# EAGLE design ESP32-S3 AT UWB Pro with Display v1.0 (EAGLE 6.1)
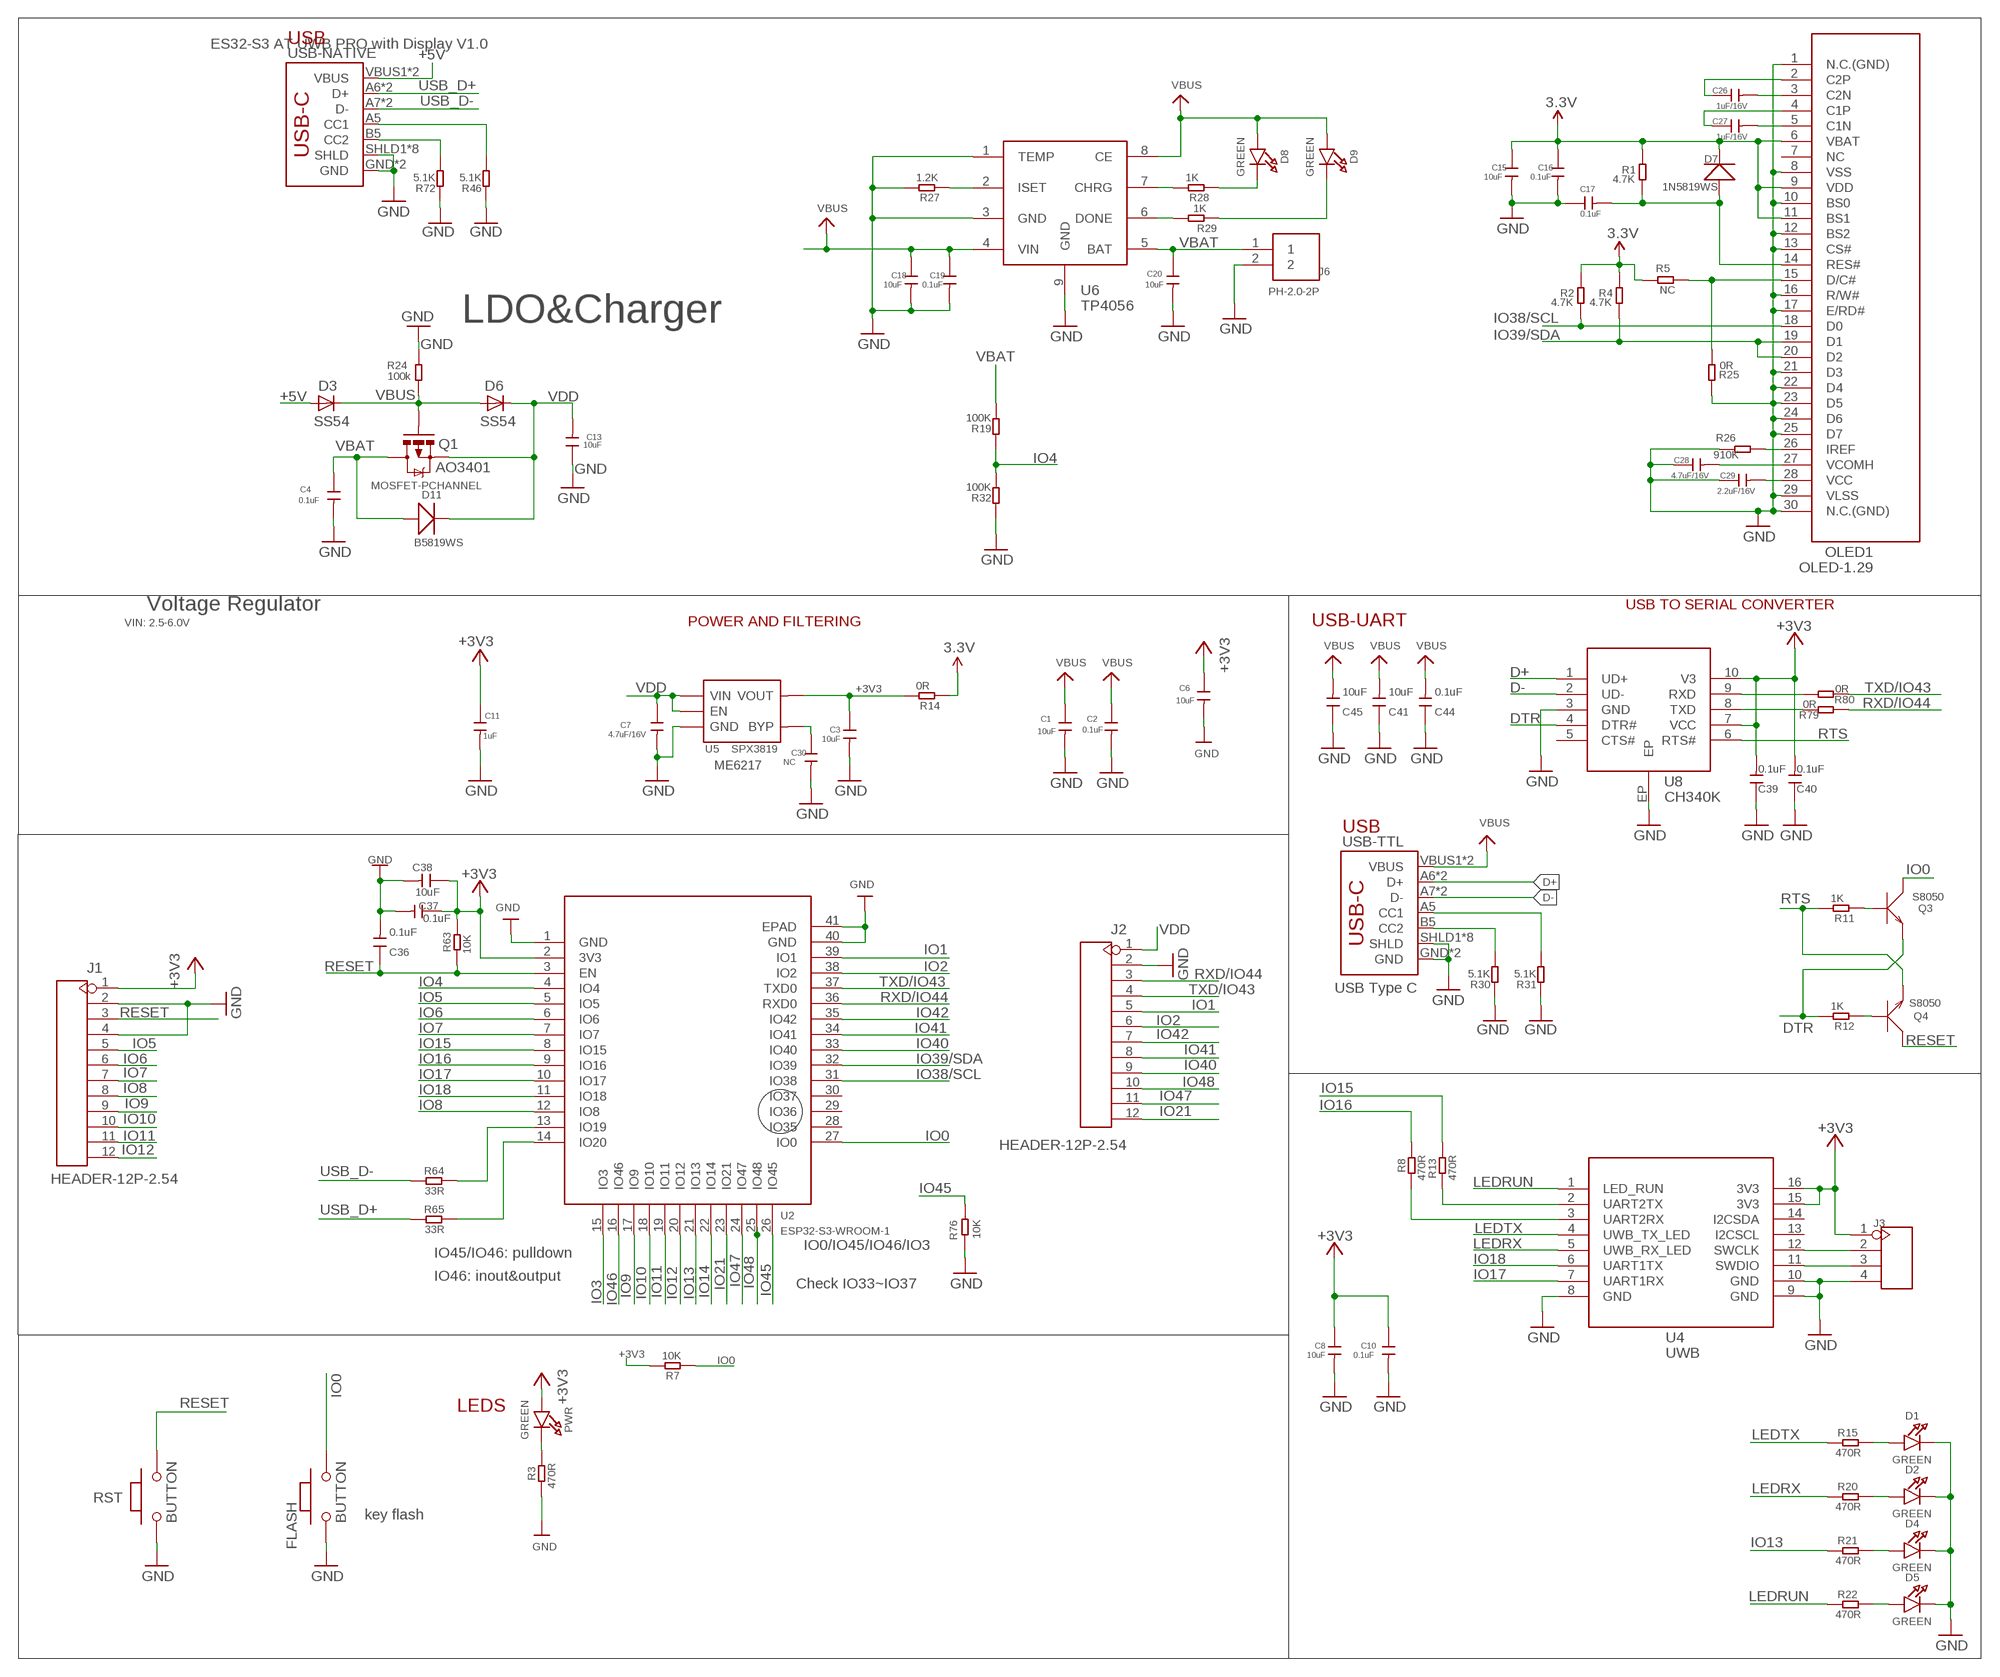
[diagram p0: schematic, sheet 1]

## Parts
C1  10uF  C-0603  [0603]
C2  0.1uF  C-0603  [0603]
C3  10uF  C-0603  [0603]
C4  0.1uF  C-0603  [0603]
C6  10uF  C-0603  [0603]
C7  4.7uF/16V  C-0603  [0603]
C8  10uF  C-0603  [0603]
C10  0.1uF  C-0603  [0603]
C11  1uF  C-0603  [0603]
C13  10uF  C-0603  [0603]
C15  10uF  C-0603  [0603]
C16  0.1uF  C-0603  [0603]
C17  0.1uF  C-0603  [0603]
C18  10uF  C-0603  [0603]
C19  0.1uF  C-0603  [0603]
C20  10uF  C-0603  [0603]
C26  1uF/16V  C-0603  [0603]
C27  1uF/16V  C-0603  [0603]
C28  4.7uF/16V  C-0603  [0603]
C29  2.2uF/16V  C-0603  [0603]
C30  NC  C-0603  [0603]
C36  0.1uF  DISCRETE_C-0603  [DISCRETE_C0603]
C37  0.1uF  DISCRETE_C-0603  [DISCRETE_C0603]
C38  10uF  DISCRETE_C-0603  [DISCRETE_C0603]
C39  0.1uF  DISCRETE_C-0603  [DISCRETE_C0603]
C40  0.1uF  DISCRETE_C-0603  [DISCRETE_C0603]
C41  10uF  DISCRETE_C-0603  [DISCRETE_C0603]
C44  0.1uF  DISCRETE_C-0603  [DISCRETE_C0603]
C45  10uF  DISCRETE_C-0603  [DISCRETE_C0603]
D1  GREEN  LED0805_NOOUTLINE  [CHIPLED_0805_NOOUTLINE]
D2  GREEN  LED0805_NOOUTLINE  [CHIPLED_0805_NOOUTLINE]
D3  SS54  DIODE-DO-214AC  [DO-214AC]
D4  GREEN  LED0805_NOOUTLINE  [CHIPLED_0805_NOOUTLINE]
D5  GREEN  LED0805_NOOUTLINE  [CHIPLED_0805_NOOUTLINE]
D6  SS54  DIODE-DO-214AC  [DO-214AC]
D7  1N5819WS  D'0805'  [SOD323]
D8  GREEN  LED0805_NOOUTLINE  [CHIPLED_0805_NOOUTLINE]
D9  GREEN  LED0805_NOOUTLINE  [CHIPLED_0805_NOOUTLINE]
D11  B5819WS  D'0805'  [SOD323]
FLASH  BUTTON  PB157  [157SW]
J1  HEADER-12P-2.54  [12P-2.54]
J2  HEADER-12P-2.54  [12P-2.54]
J3  HEADER-4P-60/35MILROUND  [4P-65/35ROUND]
J6  PH-2.0-2P  [PH-2.0-2P]
OLED1  OLED-1.29  [OLED-1.29]
PWR  GREEN  LED0805_NOOUTLINE  [CHIPLED_0805_NOOUTLINE]
Q1  MOSFET-PCHANNEL  [SOT23-3]
Q3  S8050  TRANSISTOR-NPN-SOT23  [SOT23]
Q4  S8050  TRANSISTOR-NPN-SOT23  [SOT23]
R1  4.7K  R-0603  [R0603]
R2  4.7K  R-0603  [R0603]
R3  470R  R-0603  [R0603]
R4  4.7K  R-0603  [R0603]
R5  NC  R-0603  [R0603]
R7  10K  R-0603  [R0603]
R8  470R  R-0603  [R0603]
R11  1K  R-0603  [R0603]
R12  1K  R-0603  [R0603]
R13  470R  R-0603  [R0603]
R14  0R  R-0603  [R0603]
R15  470R  R-0603  [R0603]
R19  100K  DISCRETE_R-0603  [DISCRETE_R0603]
R20  470R  R-0603  [R0603]
R21  470R  R-0603  [R0603]
R22  470R  R-0603  [R0603]
R24  100k  R-0603  [R0603]
R25  0R  R-0603  [R0603]
R26  910K  R-0603  [R0603]
R27  1.2K  R-0603  [R0603]
R28  1K  R-0603  [R0603]
R29  1K  R-0603  [R0603]
R30  5.1K  DISCRETE_R-0603  [DISCRETE_R0603]
R31  5.1K  DISCRETE_R-0603  [DISCRETE_R0603]
R32  100K  DISCRETE_R-0603  [DISCRETE_R0603]
R46  5.1K  DISCRETE_R-0603  [DISCRETE_R0603]
R63  10K  R-0603  [R0603]
R64  33R  R-0603  [R0603]
R65  33R  R-0603  [R0603]
R72  5.1K  DISCRETE_R-0603  [DISCRETE_R0603]
R76  10K  R-0603  [R0603]
R79  0R  R-0603  [R0603]
R80  0R  R-0603  [R0603]
RST  BUTTON  PB157  [157SW]
U2  ESP32-S3-WROOM-1  [ESP32-S3-WROOM-1]
U4  UWB  [UWB]
U5  SPX3819  [SOT23-5]
U6  TP4056  [SOP8-1.27P]
U8  CH340K  [ESOP-10-EP-150MIL]
USB-NATIVE  USB_C5  [USB-C-16P-5]
USB-TTL  USB_C5  [USB-C-16P-5]

## Nets
3.3V: C15.1 C16.1 D7.- OLED1.6(VBAT) OLED1.9(VDD) OLED1.11(BS1) R1.2 R2.2 R4.2 R5.2 R14.1
+3V3: C3.1 C6.1 C8.1 C10.1 C11.1 C37.1 C38.1 C39.2 C40.2 J1.1 J3.1 PWR.A R7.2 R14.2 R63.2 U2.2(3V3) U4.15(3V3) U4.16(3V3) U5.5(VOUT) U8.7(VCC) U8.10(V3)
+5V: D3.A USB-NATIVE.VBUS1(VBUS) USB-NATIVE.VBUS2(VBUS)
D+: U8.1(UD+) USB-TTL.A6(D+) USB-TTL.B6(D+)
D-: U8.2(UD-) USB-TTL.A7(D-) USB-TTL.B7(D-)
DTR: Q3.2(E) R12.2 U8.4(DTR#)
GND: C1.2 C2.2 C3.2 C4.2 C6.2 C7.2 C8.2 C10.2 C11.2 C13.1 C15.2 C16.2 C17.1 C18.2 C19.2 C20.2 C28.1 C29.1 C30.2 C36.2 C37.2 C38.2 C39.1 C40.1 C41.1 C44.1 C45.1 D1.C D2.C D4.C D5.C FLASH.1 J1.2 J1.4 J2.2 J3.4 J6.2 OLED1.1(N.C.(GND)) OLED1.8(VSS) OLED1.10(BS0) OLED1.12(BS2) OLED1.13(CS#) OLED1.16(R/W#) OLED1.17(E/RD#) OLED1.21(D3) OLED1.22(D4) OLED1.23(D5) OLED1.24(D6) OLED1.25(D7) OLED1.29(VLSS) OLED1.30(N.C.(GND)) R3.1 R24.2 R25.2 R26.2 R27.2 R30.1 R31.1 R32.1 R46.1 R72.1 R76.1 RST.1 U2.1(GND) U2.40(GND) U2.41(EPAD) U4.8(GND) U4.9(GND) U4.10(GND) U5.2(GND) U6.1(TEMP) U6.3(GND) U6.9(GND) U8.3(GND) U8.EP USB-NATIVE.GND USB-NATIVE.GND2(GND) USB-NATIVE.SHLD1(SHLD) USB-NATIVE.SHLD2(SHLD) USB-NATIVE.SHLD3(SHLD) USB-NATIVE.SHLD4(SHLD) USB-NATIVE.SHLD5(SHLD) USB-NATIVE.SHLD6(SHLD) USB-NATIVE.SHLD7(SHLD) USB-NATIVE.SHLD8(SHLD) USB-TTL.GND USB-TTL.GND2(GND) USB-TTL.SHLD1(SHLD) USB-TTL.SHLD2(SHLD) USB-TTL.SHLD3(SHLD) USB-TTL.SHLD4(SHLD) USB-TTL.SHLD5(SHLD) USB-TTL.SHLD6(SHLD) USB-TTL.SHLD7(SHLD) USB-TTL.SHLD8(SHLD)
IO0: FLASH.2 Q3.3(C) R7.1 U2.27(IO0)
IO1: J2.5 U2.39(IO1)
IO2: J2.6 U2.38(IO2)
IO3: U2.15(IO3)
IO4: R19.1 R32.2 U2.4(IO4)
IO5: J1.5 U2.5(IO5)
IO6: J1.6 U2.6(IO6)
IO7: J1.7 U2.7(IO7)
IO8: J1.8 U2.12(IO8)
IO9: J1.9 U2.17(IO9)
IO10: J1.10 U2.18(IO10)
IO11: J1.11 U2.19(IO11)
IO12: J1.12 U2.20(IO12)
IO13: R21.1 U2.21(IO13)
IO14: U2.22(IO14)
IO15: R13.2 U2.8(IO15)
IO16: R8.2 U2.9(IO16)
IO17: U2.10(IO17) U4.7(UART1RX)
IO18: U2.11(IO18) U4.6(UART1TX)
IO21: J2.12 U2.23(IO21)
IO38/SCL: OLED1.18(D0) R2.1 U2.31(IO38)
IO39/SDA: OLED1.19(D1) OLED1.20(D2) R4.1 U2.32(IO39)
IO40: J2.9 U2.33(IO40)
IO41: J2.8 U2.34(IO41)
IO42: J2.7 U2.35(IO42)
IO45: R76.2 U2.26(IO45)
IO46: U2.16(IO46)
IO47: J2.11 U2.24(IO47)
IO48: J2.10 U2.25(IO48)
LEDRUN: R22.1 U4.1(LED_RUN)
LEDRX: R20.1 U4.5(UWB_RX_LED)
LEDTX: R15.1 U4.4(UWB_TX_LED)
N$1: D1.A R15.2
N$2: R64.2 U2.13(IO19)
N$3: C17.2 D7.+ OLED1.14(RES#) R1.1
N$4: OLED1.15(D/C#) R5.1 R25.1
N$5: PWR.C R3.2
N$6: C28.2 OLED1.27(VCOMH)
N$7: C26.2 OLED1.3(C2N)
N$8: C29.2 OLED1.28(VCC)
N$9: OLED1.26(IREF) R26.1
N$10: R13.1 U4.2(UART2TX)
N$11: R8.1 U4.3(UART2RX)
N$13: Q4.1(B) R12.1
N$14: Q3.1(B) R11.1
N$16: D2.A R20.2
N$17: D4.A R21.2
N$18: D5.A R22.2
N$19: C26.1 OLED1.2(C2P)
N$21: C27.1 OLED1.4(C1P)
N$22: C27.2 OLED1.5(C1N)
N$23: R27.1 U6.2(ISET)
N$25: R31.2 USB-TTL.A5(CC1)
N$26: R30.2 USB-TTL.B5(CC2)
N$27: J3.3 U4.11(SWDIO)
N$28: J3.2 U4.12(SWCLK)
N$29: R28.2 U6.7(CHRG)
N$30: R29.2 U6.6(DONE)
N$31: D8.C R28.1
N$32: D9.C R29.1
N$33: R46.2 USB-NATIVE.A5(CC1)
N$34: R72.2 USB-NATIVE.B5(CC2)
N$35: R65.2 U2.14(IO20)
N$36: R80.2 U8.9(RXD)
N$37: R79.2 U8.8(TXD)
N$76: C30.1 U5.4(BYP)
RESET: C36.1 J1.3 Q4.3(C) R63.1 RST.2 U2.3(EN)
RTS: Q4.2(E) R11.2 U8.6(RTS#)
RXD/IO44: J2.3 R79.1 U2.36(RXD0)
TXD/IO43: J2.4 R80.1 U2.37(TXD0)
USB_D+: R65.1 USB-NATIVE.A6(D+) USB-NATIVE.B6(D+)
USB_D-: R64.1 USB-NATIVE.A7(D-) USB-NATIVE.B7(D-)
VBAT: C4.1 C20.1 D11.+ J6.1 Q1.3(D) R19.2 U6.5(BAT)
VBUS: C1.1 C2.1 C18.1 C19.1 C41.2 C44.2 C45.2 D3.C D6.A D8.A D9.A Q1.1(G) R24.1 U6.4(VIN) U6.8(CE) USB-TTL.VBUS1(VBUS) USB-TTL.VBUS2(VBUS)
VDD: C7.1 C13.2 D6.C D11.- J2.1 Q1.2(S) U5.1(VIN) U5.3(EN)
Unconnected: OLED1.7(NC) U2.28(IO35) U2.29(IO36) U2.30(IO37) U4.13(I2CSCL) U4.14(I2CSDA) U8.5(CTS#)

## Notes on the sheet
- USB
- ES32-S3 AT UWB PRO with Display V1.0
- LDO&Charger
- AO3401
- Voltage Regulator
- USB TO SERIAL CONVERTER
- VIN: 2.5-6.0V | POWER AND FILTERING | USB-UART
- ME6217
- USB
- USB Type C
- IO0/IO45/IO46/IO3
- IO45/IO46: pulldown
- IO46: inout&output
- Check IO33~IO37
- LEDS
- key flash

## Library data of the parts
C1-C4 C6-C8 C10 C11 C13 C15-C20 C26-C30 = Discrete:C*: Ceramic Capacitors
C36-C41 C44 C45 = A9G:DISCRETE_C*: Ceramic Capacitors
D1 D2 D4 D5 D8 D9 PWR = microbuilder:LED: LED 0603 - 0603 Surface Mount Package 2mA: Green LED - Low Power (3.9mcd, 2ma, 1.7Vf) - Digikey: 475-2709-2-ND Orange LED - Low Power (9.8mcd, 2ma, 1.8Vf) - Digikey: 475-1194-2-ND Red LED - Low Power (5mcd, 2ma, 1.8Vf) - Digikey: 475-1195-2-ND Yellow LED - Low Power (7mcd, 2ma, 1.8Vf) - Digikey: 475-1196-2-ND 5mA: Blue LED - Low Power (17mcd, 5ma, 2.9Vf) - Digikey: LNJ937W8CRACT-ND 0805 - 0805 Surface Mount Package 2mA: Red LED (8.8mcd, 2mA, 1.8Vf, Clear) - Low Power [Digikey: 475-2510-1-ND] Green LED (5mcd, 2mA, 1.8Vf, Clear) - Low Power [Digikey: 475-2730-1-ND] Yellow LED (11.3mcd, 2mA, 1.8Vf, Clear) - Low Power [Digikey: 475-2555-1-ND] 20mA: Red LED (104mcd, 20mA, Diffused) - LS R976 [Digikey: 475-1278-6-ND] Red LED (12mcd, 20mA, 2.0Vf, Clear) - APT2012EC [Digikey: 754-1128-1-ND] Green LED (15mcd, 20mA, 2.2Vf, Clear) - APT2012GC [Digikey: 754-1131-1-ND] Orange LED (160mcd, 20mA, 2.1Vf, Clear) - APT2012SECK [Digikey: 754-1130-1-ND] 1206 - 1206 Surface Mount Package Green LED (26mcd, 20mA, Diffused) - LG N971 [Digikey: 475-1407-6-ND] Red LED (15mcd, 20mA, Diffused) - LH N974 [Digikey: 475-1416-6-ND] Cree - Cree High-Power Surface Mount LEDs XPEBWT-L1-0000-00D50 - White 111lm 350mA 2.9Vf 6200K 110° XTEAWT-00-0000-00000LEE3 - White 114lm 350mA 2.85Vf 5000K 115° Everlight - Everlight 45-21 Series Surface Mount LEDs 45-21/QK2C-B2832AC2CB2/2T - Warm White 2000mcd 20mA 3.25Vf 3050K 120° 45-21/LK2C-B38452C4CB2/2T - Nuetral White 2000mcd 20mA 3.25Vf 4150K 120° 45-21/LK2C-B50634C6CB2/2T - Cold White 2200mcd 20mA 3.25Vf 5650K 120° PLCC2 Reverse Mount LS T77K-J1L2-1-0-2-R18-Z - Red 11.25mcd 2mA 1.8Vf 630nm 120° LO T77K-L1M2-24-Z - Orange 19.6mcd 2mA 1.8Vf 606nm 120° LY T77K-K2M1-26-Z - Yellow 15.7mcd 2mA 1.8Vf 587nm 120°
D3 D6 = diode:DIODE-: DIODE
D7 D11 = Discrete:D*
FLASH RST = MySMD:PB157
J1 J2 = Connector:HEADER-12P
J3 = Connector:HEADER-4P
J6 = Connector:PH-2.0-2P
OLED1 = sale:OLED-1.29
Q1 = User-Submitted:MOSFET-PCHANNEL: Generic PMOSFET IRLML2244 - TRANS-11153 (SOT-23 -20V -4.3A) (1.Gate 2.Source 3.Drain) FQP27P06 - COM-10349 <http://www.sparkfun.com/products/10349> (TO-220 -60V -27A) (1.Gate 2.Source 3.Drain); PROD_ID: TRANS-08285
Q3 Q4 = Discrete:TRANSISTOR-NPN*: NPN audion
R1-R5 R7 R8 R11-R15 R20-R22 R24-R29 R63-R65 R76 R79 R80 = Discrete:R*
R19 R30-R32 R46 R72 = A9G:DISCRETE_R*
U2 = self:ESP32-S3-WROOM-1
U4 = sale:UWB
U5 = IC:SPX3819
U6 = self:TP4056
U8 = sale:CH340K
USB-NATIVE USB-TTL = USBC:USB_C: USB Type C 16Pin Connector Super Speed pins not available on the 16-pin purely SMD connector so this part is best for USB 2.0 implementations. D1 and D2 are tied together enabling D+/- no matter which way the cable is plugged into the connector. The two channel configuration pins (CC1/2) are exposed. These are normally connected to ground via 5.1k resistors but can be reconfigured for high current/high power applications.

## Net classes
0 default: width 0.203 mm

## Board
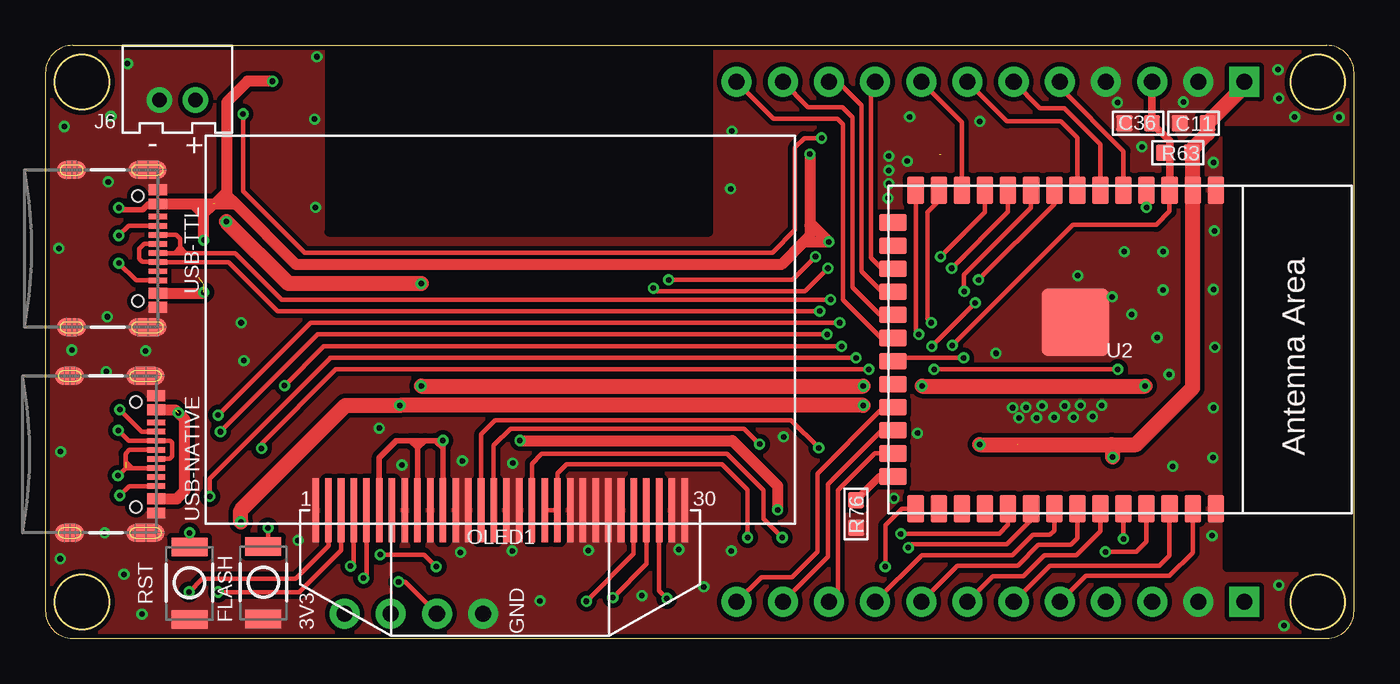
[diagram p1: board, top side]
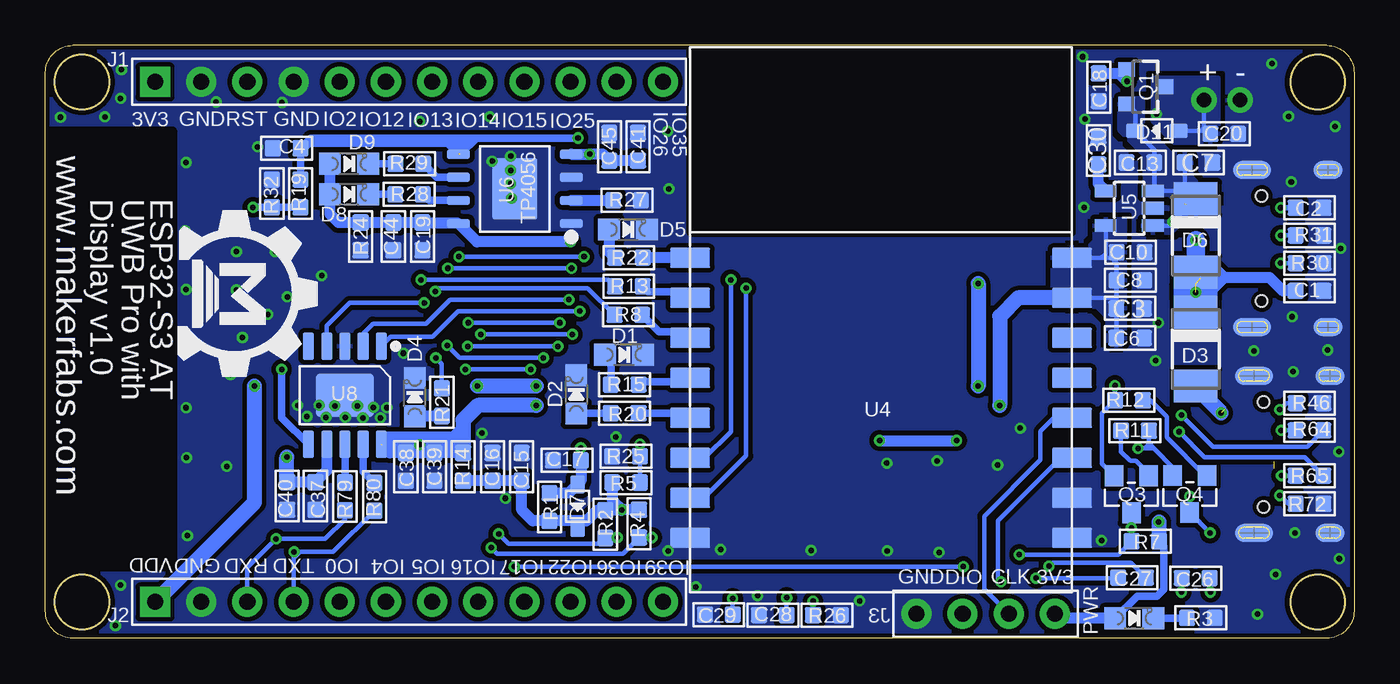
[diagram p2: board, bottom side, seen from below]

Size 72 x 32.6 mm. Coordinates in mm from the lower left corner, seen from the top.
Outline: 70.5,0 arc90 72,1.5 72,31.1 arc90 70.5,32.6 1.5,32.6 arc90 0,31.1 0,1.5 arc90 1.5,0 70.5,0
Outline: circle at 2,2 radius 1.5
Outline: circle at 2,30.6 radius 1.5
Outline: circle at 70,30.6 radius 1.5
Outline: circle at 70,2 radius 1.5
Copper layers (1*16): Top 0.035mm / dielectric 1.5mm / Bottom 0.035mm
Design rules: minimum track width 10mil, minimum drill 10mil, track to track 8mil, track to pad 8mil, pad to pad 8mil, via to via 8mil, smd to smd 0mil, copper to edge 10mil, drill to drill 8mil, minimum pad ring 10mil, minimum via ring 6mil, stop-mask expansion 4mil, vias tented up to drill 100mil, thermal gap 0mil
tRestrict: area 65,3.9 to 72,27.9; area 15.6,22.3 to 36.5,34.4
bRestrict: area 65,3.9 to 72,27.9; area 15.6,22.3 to 36.5,34.4

### Footprints (pad centres in the part's own frame; a part is rotated, then mirrored left to right if it is on the bottom)
0603 = smd 0.889 x 0.889: 1 -0.762,0; 2 0.762,0
DISCRETE_C0603 = smd 0.889 x 0.889: 1 -0.762,0; 2 0.762,0
CHIPLED_0805_NOOUTLINE = smd 1.2 x 1.2: A 0,-1.05; C 0,1.05
DO-214AC = smd 1.8 x 2.4: A 2.025,0; C -2.025,0
SOD323 = smd 1 x 0.8: + -1.2,0; - 1.2,0
157SW = smd 1.016 x 1.981: 1 0,0; 2 4,0
12P-2.54 = drill 0.889 pad 1.651 square: 1 0,13.97 | drill 0.889 pad 1.651: 2 0,11.43; 3 0,8.89; 4 0,6.35; 5 0,3.81; 6 0,1.27; 7 0,-1.27; 8 0,-3.81; 9 0,-6.35; 10 0,-8.89; 11 0,-11.43; 12 0,-13.97
4P-65/35ROUND = drill 0.889 pad 1.651: 1 0,3.81; 2 0,1.27; 3 0,-1.27; 4 0,-3.81
PH-2.0-2P = drill 0.8 pad 1.4: 1 -1,0; 2 1,0
OLED-1.29 = smd 0.4 x 3.5: 1 -10.15,-9.94; 2 -9.45,-9.94; 3 -8.75,-9.94; 4 -8.05,-9.94; 5 -7.35,-9.94; 6 -6.65,-9.94; 7 -5.95,-9.94; 8 -5.25,-9.94; 9 -4.55,-9.94; 10 -3.85,-9.94; 11 -3.15,-9.94; 12 -2.45,-9.94; 13 -1.75,-9.94; 14 -1.05,-9.94; 15 -0.35,-9.94; 16 0.35,-9.94; 17 1.05,-9.94; 18 1.75,-9.94; 19 2.45,-9.94; 20 3.15,-9.94; 21 3.85,-9.94; 22 4.55,-9.94; 23 5.25,-9.94; 24 5.95,-9.94; 25 6.65,-9.94; 26 7.35,-9.94; 27 8.05,-9.94; 28 8.75,-9.94; 29 9.45,-9.94; 30 10.15,-9.94
SOT23-3 = smd 0.8 x 0.9: 1 -0.95,-1; 2 0.95,-1; 3 0,1.1
SOT23 = smd 1.016 x 1.143: 1 -0.95,-1.016; 2 0.95,-1.016; 3 0,1.016
R0603 = smd 0.889 x 0.889: 1 -0.762,0; 2 0.762,0
DISCRETE_R0603 = smd 0.889 x 0.889: 1 -0.762,0; 2 0.762,0
ESP32-S3-WROOM-1 = smd 1.5 x 0.9: 1 -8.75,5.26; 2 -8.75,3.99; 3 -8.75,2.72; 4 -8.75,1.45; 5 -8.75,0.18; 6 -8.75,-1.09; 7 -8.75,-2.36; 8 -8.75,-3.63; 9 -8.75,-4.9; 10 -8.75,-6.17; 11 -8.75,-7.44; 12 -8.75,-8.71; 13 -8.75,-9.98; 14 -8.75,-11.25; 27 8.75,-11.25; 28 8.75,-9.98; 29 8.75,-8.71; 30 8.75,-7.44; 31 8.75,-6.17; 32 8.75,-4.9; 33 8.75,-3.63; 34 8.75,-2.36; 35 8.75,-1.09; 36 8.75,0.18; 37 8.75,1.45; 38 8.75,2.72; 39 8.75,3.99; 40 8.75,5.26 | smd 0.9 x 1.5: 15 -6.985,-12.5; 16 -5.715,-12.5; 17 -4.445,-12.5; 18 -3.175,-12.5; 19 -1.905,-12.5; 20 -0.635,-12.5; 21 0.635,-12.5; 22 1.905,-12.5; 23 3.175,-12.5; 24 4.445,-12.5; 25 5.715,-12.5; 26 6.985,-12.5 | smd 3.7 x 3.7: 41 -1.5,-2.46
UWB = smd 2.2 x 1.1: 1 0,18.4; 2 0,16.2; 3 0,14; 4 0,11.8; 5 0,9.6; 6 0,7.4; 7 0,5.2; 8 0,3; 9 21,3; 10 21,5.2; 11 21,7.4; 12 21,9.6; 13 21,11.8; 14 21,14; 15 21,16.2; 16 21,18.4
SOT23-5 = smd 0.69 x 1.2: 1 -0.95,-1.3; 2 0,-1.3; 3 0.95,-1.3; 4 0.95,1.3; 5 -0.95,1.3
SOP8-1.27P = smd 1.27 x 0.51: 1 -3.1,1.905; 2 -3.1,0.635; 3 -3.1,-0.635; 4 -3.1,-1.905; 5 3.1,-1.905; 6 3.1,-0.635; 7 3.1,0.635; 8 3.1,1.905 | smd 2.5 x 3.4: 9 0,0
ESOP-10-EP-150MIL = smd 1.5 x 0.6: 1 -2.7,2; 2 -2.7,1; 3 -2.7,0; 4 -2.7,-1; 5 -2.7,-2; 6 2.7,-2; 7 2.7,-1; 8 2.7,0; 9 2.7,1; 10 2.7,2 | smd 2.4 x 3.2: EP 0,0
USB-C-16P-5 = smd 0.3 x 1: A5 -1.25,-0.34; A6 -0.25,-0.34; A7 0.25,-0.34; A8 1.25,-0.34; B5 1.75,-0.34; B6 0.75,-0.34; B7 -0.75,-0.34; B8 -1.75,-0.34 | smd 0.6 x 1: GND -3.225,-0.34; GND2 3.225,-0.34; VBUS1 -2.45,-0.34; VBUS2 2.45,-0.34 | smd 1 x 2.1: SHLD1 -4.32,-0.915; SHLD2 4.32,-0.915 | smd 1 x 2.1 bottom: SHLD3 -4.32,-0.915; SHLD4 4.32,-0.915 | smd 1 x 1.6: SHLD5 -4.32,-5.095; SHLD8 4.32,-5.095 | smd 1 x 1.6 bottom: SHLD6 -4.32,-5.095; SHLD7 4.32,-5.095 | hole 0.65: -2.89,-1.445; 2.89,-1.445

### Placement (x,y rotation side)
C1  2.45,19.1 0 bottom
C2  2.45,23.67 0 bottom
C3  12.32,18.14 0 bottom
C4  58.72,26.95 180 bottom
C6  12.32,16.51 0 bottom
C7  8.56,26.16 0 bottom
C8  12.31,19.68 0 bottom
C10  12.3,21.23 0 bottom
C11  63.17,28.32 180 top
C13  11.76,26.16 0 bottom
C15  45.8,9.42 90 bottom
C16  47.4,9.42 90 bottom
C17  43.31,9.78 0 bottom
C18  14.05,30.3 270 bottom
C19  51.26,22.1 270 bottom
C20  7.14,27.74 0 bottom
C26  8.71,3.3 180 bottom
C27  12.22,3.33 180 bottom
C28  31.98,1.27 0 bottom
C29  34.95,1.3 0 bottom
C30  14.07,26.82 90 bottom
C36  60.12,28.32 180 top
C37  57.15,7.82 270 bottom
C38  52.17,9.42 270 bottom
C39  50.6,9.42 90 bottom
C40  58.7,7.82 90 bottom
C41  39.4,27.03 270 bottom
C44  52.86,22.1 90 bottom
C45  40.97,27.03 270 bottom
D1  40.17,15.59 270 bottom
D2  42.79,13.41 0 bottom
D3  8.71,15.9 270 bottom
D4  51.68,13.26 0 bottom
D5  39.94,22.47 270 bottom
D6  8.71,22.15 270 bottom
D7  42.72,7.26 270 bottom
D8  55.3,24.41 270 bottom
D9  55.3,26.09 270 bottom
D11  10.85,27.91 180 bottom
FLASH  11.99,1.05 90 top
J1  52,30.6 90 bottom
J2  52,2 90 bottom
J3  20.27,1.35 270 bottom
J6  7.26,29.59 180 top
OLED1  25.02,16.97 0 top
PWR  12.1,1.1 270 bottom
Q1  11.51,30.33 270 bottom
Q3  12.24,7.91 180 bottom
Q4  9.04,7.93 180 bottom
R1  44.27,7.21 270 bottom
R2  41.2,6.27 90 bottom
R3  8.43,1.12 180 bottom
R4  39.34,6.3 90 bottom
R5  40.06,8.56 180 bottom
R7  11.49,5.33 0 bottom
R8  39.93,17.78 180 bottom
R11  12.06,11.41 0 bottom
R12  12.38,13.09 180 bottom
R13  39.9,19.35 180 bottom
R14  49.02,9.42 90 bottom
R15  40.13,13.94 180 bottom
R19  57.96,24.46 90 bottom
R20  40.13,12.37 180 bottom
R21  50.19,12.98 270 bottom
R22  39.9,20.93 180 bottom
R24  54.66,22.1 270 bottom
R25  40.06,10.01 180 bottom
R26  29.01,1.27 0 bottom
R27  40.01,24.08 0 bottom
R28  51.99,24.41 0 bottom
R29  51.97,26.09 0 bottom
R30  2.45,20.62 180 bottom
R31  2.45,22.15 180 bottom
R32  59.54,24.46 270 bottom
R46  2.45,12.93 180 bottom
R63  62.31,26.7 0 top
R64  2.45,11.43 0 bottom
R65  2.45,8.94 0 bottom
R72  2.45,7.39 180 bottom
R76  44.6,6.83 90 top
R79  55.52,7.8 90 bottom
R80  53.9,7.77 90 bottom
RST  7.92,1.02 90 top
U2  59.13,15.88 270 top
U4  36.53,2.51 0 bottom
U5  12.37,23.65 90 bottom
U6  46.18,24.71 180 bottom
U8  55.52,13.36 270 bottom
U$1  [MAKERFABS_0.3]  64.66,23.06 270 bottom
USB-NATIVE  6.43,10.11 270 top
USB-TTL  6.53,21.43 270 top

### Tracks (layer width: path | path; a pad name or v marks a point on that pad's centre or on a via)
3.3V  (via drill 0.3)
  Top 0.254: OLED1.11
  Top 0.305: OLED1.6 18.37,9.94 19.3,10.87 20.07,10.87 | 20.07,10.87 20.42,10.87 | 20.42,10.87 20.88,10.87 | 21.44,10.87 v21.87,10.87 | OLED1.11 v21.87,10.87 | v21.87,10.87 | OLED1.9 20.47,10.82 20.42,10.87 | 20.07,10.87 20.47,10.46 20.88,10.87 | 20.88,10.87 21.44,10.87 | 21.44,10.87 21.87,10.44 21.87,10.39
  Top 0.61: v26.11,10.87 37.8,10.87 40.28,8.38 v40.28,7.06
  Bottom 0.61: v26.11,10.87 v21.87,10.87 | R14.1 C16.1 C15.1 45.8,7.06 45.19,6.45 R1.2 42.8,6.45 | R4.2 v40.28,7.06 | v40.28,7.06 40.31,7.04 R2.2 41.66,7.04 42.24,6.45 42.8,6.45 | D7.- 42.8,6.14 42.8,6.45 | R5.2 40.82,7.59 v40.28,7.06
+3V3  (via drill 0.3)  (1 unrouted)
  Top 0.813: v51.41,10.64 58.65,10.64 | 58.65,10.64 59.99,10.64 63.12,13.77 U2.2 63.12,26.54 | v58.73,9.96 58.73,10.57 58.65,10.64 | v45,12.8 v19.5,12.8 16.51,12.8 10.74,7.04 v10.74,6.4 | J1.1 65.97,30.36 C11.1 63.93,27.74 63.12,26.93 63.12,26.54 | R63.2 63.07,26.6 63.12,26.54
  Bottom 0.254: C6.1 C3.1 13.08,18.67 | 13.08,18.67 13.08,19.67 C8.1 13.07,20.65 13.33,20.91 13.89,20.91 | C10.1 | U4.16 13.89,20.91 | 13.08,18.67 13.13,18.71 U4.15 | U5.5 13.67,21.14 13.89,20.91 | 10.72,6.38 v10.74,6.4
  Bottom 0.406: PWR.A 11.94,2.31 10.85,2.31 10.46,2.69 10.46,5.07 R7.2 | 49.12,11.63 49.61,11.15 53.62,11.15 53.37,10.9 49.43,10.9 49.43,10.62 53.19,10.62 53.21,10.64 53.47,10.64
  Bottom 0.61: U8.7 56.52,9.21 C37.1 C40.2 | R14.2 C39.2 51.38,10.19 | 51.38,10.19 C38.1 53.05,10.19 U8.10 | v51.41,10.64 51.41,10.21 51.38,10.19 | PWR.A 16.21,1.1 J3.1
  Bottom 0.813: R7.2 10.72,6.38 | C40.2 58.73,8.61 v58.73,9.96 | v45,12.8 48.21,12.8 49.02,11.99 R14.2 | U4.15 18.5,18.71 19.5,17.71 v19.5,12.8
  pour Bottom: 12.62,16.08 12.62,23.04 14.3,23.04 14.3,21.84 14.63,21.51 16.61,21.51 16.61,18.24 14.15,18.24 13.56,17.65 13.56,16.08
+5V  (via drill 0.3)  (1 unrouted)
  Top 0.254: 6.1,12.55 USB-NATIVE.VBUS1
  Top 0.61: USB-NATIVE.VBUS2 7.23,7.66 7.67,8.1 7.67,12.04 7.15,12.56 USB-NATIVE.VBUS1
  Bottom 0.813: v7.32,12.39 8.71,13.79 D3.A
D+  (via drill 0.3)
  Top 0.254: USB-TTL.A6 5.42,21.68 5.16,21.41 5.16,20.88 5.33,20.7 6.17,20.7 USB-TTL.B6 10.08,20.68 12.78,17.98 v42.6,17.98
  Bottom 0.254: v42.6,17.98 49.3,17.98 50.7,16.59 53,16.59 U8.1
D-  (via drill 0.3)
  Top 0.254: 7.72,21.18 10.44,21.18 13.01,18.62 v43.2,18.62 | 7.72,21.18 7.44,21.18 | 7.44,21.18 7.11,21.18 | 7.11,21.18 USB-TTL.A7 | USB-TTL.B7 7.21,22.18 7.42,21.97 7.42,21.49 | 7.42,21.49 7.42,21.21 7.44,21.18 | 7.11,21.18 7.42,21.49 | 7.42,21.49 7.72,21.18
  Bottom 0.254: v43.2,18.62 49.73,18.62 51.05,17.3 53.98,17.3 54.52,16.75 U8.2
DTR  (via drill 0.3)
  Top 0.254: v43.8,16.05 15.32,16.05 v13.16,13.89 | v51.16,18.44 v48.77,16.06 v48.77,16.05
  Bottom 0.254: v43.8,16.05 v48.77,16.05 | U8.4 56.54,16.08 56.54,17.17 55.27,18.44 v51.16,18.44 | Q3.2 13.87,9.6 13.87,12.37 R12.2 13.16,13.1 v13.16,13.89
GND  (via drill 0.3)
  other vias: 5.31,1.32 19.61,9.53 22.94,9.75 18.36,11.56 25.7,9.63 27.2,2.06 29.87,4.83 25.68,4.8 22.83,4.72 32.82,2.34 34.85,4.88 40.61,11.07 37.69,24.71 37.77,27.89 14.81,28.55 14.94,31.98 14.86,23.7 4.52,31.6 3.61,28.7 1.04,28.14 0.74,21.44 3.45,25.1 3.4,17.68 5.51,15.8 1.45,15.85 3.35,14.66 0.84,10.26 3.25,5.79 0.81,4.37 4.32,3.51 13.89,5.38 10.92,15.27 10.77,17.35 47.55,28.68 46.41,26.52 47.42,26.24 46.41,25.73 46.35,24.21 46.41,24.99 51.41,28.42 60.33,27.03 58.98,29.46 62.61,29.49 67.82,31.27 67.87,29.69 71.17,28.65 68.73,28.68 64.26,26.16 64.31,22.4 64.26,19.18 64.34,16 64.26,12.67 64.24,9.93 62.03,9.45 61.16,16.54 56.79,19.94 61.49,21.26 59.36,21.26 61.49,19.15 58.7,18.77 59.77,17.81 64.19,5.64 68.15,0.69 67.87,2.92 46.69,7.7 47.98,11.28 58.12,12.8 56.95,12.8 56.08,12.78 54.84,12.78 53.95,12.7 53.21,12.67 53.57,12.12 54.53,12.12 55.5,12.14 56.57,12.14 57.61,12.19 61.82,14.5 52.3,15.67 37.74,4.8 36.22,2.82
  pour Top (isolate 0.254, rank 6): -8.51,60 75.44,60 75.44,-10 -8.52,-10 -8.52,37.36
  pour Bottom (isolate 0.254, rank 6): -2.29,60 76.2,60 76.2,-10 -2.29,-10
IO0  (via drill 0.3)
  Top 0.254: U2.27 47.13,7.12 46.2,6.2 v46.2,3.94 | v18.41,4.6 20.84,4.6 v21.5,3.94 | FLASH.2 12.25,5.3 v12.25,6.07
  Bottom 0.254: v21.5,3.94 v46.2,3.94 | v18.41,4.6 12.98,4.6 R7.1 v12.25,6.07 Q3.3
IO1
  Top 0.254: J2.5 57.24,3.43 61.85,3.43 63.12,4.7 U2.39
IO2
  Top 0.254: J2.6 55.26,3.99 61.29,3.99 61.85,4.55 U2.38
IO4  (via drill 0.3)
  Top 0.406: U2.4 v60.58,23.7
  Bottom 0.406: R19.1 R32.2 v60.58,23.7
IO5
  Top 0.254: U2.5 59.31,26.8 55.81,30.3 J1.5
IO6
  Top 0.254: U2.6 58.04,27.18 56.06,29.16 54.71,29.16 J1.6
IO7
  Top 0.254: U2.7 56.77,27.53 55.88,28.42 52.91,28.42 J1.7
IO8
  Top 0.254: U2.12 50.42,28.37 J1.8
IO9
  Top 0.254: U2.17 46.02,20.32 45.41,20.93 45.41,30.36 J1.9
IO10
  Top 0.254: U2.18 46.02,19.05 44.91,20.17 44.91,29.31 43.61,30.61 J1.10
IO11
  Top 0.254: U2.19 45.92,17.78 44.4,19.3 44.4,28.65 43.84,29.21 41.96,29.21 J1.11
IO12
  Top 0.254: U2.20 46,16.51 43.89,18.62 43.89,28.27 43.59,28.57 40.05,28.57 J1.12
IO13  (via drill 0.3)
  Top 0.254: U2.21 46.81,15.42 v50.52,15.42
  Bottom 0.254: R21.1 50.19,15.09 v50.52,15.42
IO15  (via drill 0.3)
  Top 0.254: v51.33,19.71 55.5,23.88 U2.8
  Bottom 0.254: v51.33,19.71 41.02,19.71 R13.2
IO16  (via drill 0.3)
  Top 0.254: v50.55,19.07 50.55,19.99 54.23,23.68 U2.9
  Bottom 0.254: v50.55,19.07 50.37,19.25 42.16,19.25 R8.2
IO17  (via drill 0.3)
  Top 0.254: U2.10 52.96,23.44 v49.86,20.34 | v43.05,20.34 41.78,19.07 33.63,19.07 v33.45,19.25
  Bottom 0.254: v43.05,20.34 v49.86,20.34 | U4.7 35.77,7.71 33.45,10.03 v33.45,19.25
IO18  (via drill 0.3)
  Top 0.254: U2.11 51.69,23.42 v49.25,20.98 | v34.29,19.71 41.1,19.71 v42.37,20.98
  Bottom 0.254: v42.37,20.98 v49.25,20.98 | U4.6 35.73,9.91 34.29,11.35 v34.29,19.71
IO21
  Top 0.254: J2.12 39.38,3.35 41.07,3.35 42.47,4.75 42.47,9.04 45.92,12.5 46.43,12.5 U2.23
IO38/SCL  (via drill 0.3)
  Top 0.254: U2.31 52.96,6.22 52.48,5.74 v47.07,5.74 | OLED1.18 26.77,9.6 27.3,10.13 37.49,10.13 39.5,8.13 39.5,6.58 v40.54,5.54
  Bottom 0.254: v47.07,5.74 46.51,5.18 41.53,5.18 R2.1 41.17,5.54 v40.54,5.54
IO39/SDA  (via drill 0.3)
  Top 0.254: OLED1.19 OLED1.20 28.17,9.07 28.68,9.58 37.21,9.58 38.63,8.15 v38.63,5.54 | U2.32 54.23,6.48 52.91,5.16 47.65,5.16 v47.47,4.98
  Bottom 0.254: v47.47,4.98 47.14,4.65 40.23,4.65 R4.1 v38.63,5.54
IO40
  Top 0.254: J2.9 48.22,4.57 53.21,4.57 54.33,5.69 55.27,5.69 55.5,5.92 U2.33
IO41
  Top 0.254: J2.8 50.18,3.99 53.49,3.99 54.63,5.13 56.41,5.13 56.77,5.49 U2.34
IO42
  Top 0.254: J2.7 52.13,3.4 53.8,3.4 54.97,4.57 56.72,4.57 58.04,5.89 U2.35
IO45
  Top 0.406: U2.26 45.9,8.89 R76.2
IO47
  Top 0.254: J2.11 43.05,4.48 43.05,8.46 46.02,11.43 U2.24
IO48
  Top 0.254: J2.10 43.61,2.5 43.61,8.13 45.64,10.16 U2.25
LEDRUN
  Bottom 0.61: U4.1 39.13,20.91 R22.1
LEDRX
  Bottom 0.406: R20.1 36.78,12.37 U4.5
LEDTX
  Bottom 0.406: R15.1 39.22,14.1 37.24,14.1 37.02,14.31 U4.4
N$1
  Bottom 0.406: D1.A 40.89,15.27 R15.2
N$2  (via drill 0.3)
  Top 0.254: v43.7,17.35 14.58,17.35 v9.5,12.27 | v48.74,17.35 48.51,17.58 48.51,23.42 49.15,24.05 U2.13
  Bottom 0.254: v48.74,17.35 v43.7,17.35 | v9.5,12.27 7.77,10.54 2.58,10.54 R64.2
N$3  (via drill 0.3)
  Top 0.254: OLED1.14 23.97,11.22 24.74,11.99 41.02,11.99 v42.55,10.46
  Bottom 0.254: v42.55,10.46 C17.2
  Bottom 0.61: C17.2 42.55,8.64 D7.+ 43.21,7.98 R1.1
N$4  (via drill 0.3)
  Top 0.254: OLED1.15 24.67,10.62 25.58,11.53 38.43,11.53 v39.29,10.67
  Bottom 0.254: R5.1 R25.1 v39.29,10.67
N$5
  Bottom 0.406: PWR.C 9.21,1.1 R3.2
N$6  (via drill 0.3)
  Top 0.254: OLED1.27 33.07,4.09 v31.22,2.23
  Bottom 0.254: v31.22,2.23 C28.2
N$7  (via drill 0.3)
  Top 0.254: OLED1.3 16.27,4.84 13.97,2.54 v9.5,2.54
  Bottom 0.254: C26.2 9.47,2.56 v9.5,2.54
N$8  (via drill 0.3)
  Top 0.254: OLED1.28 33.77,2.6 v34.19,2.18
  Bottom 0.254: v34.19,2.18 C29.2
N$9  (via drill 0.3)
  Top 0.254: OLED1.26 32.37,4.63 v29.77,2.03
  Bottom 0.254: v29.77,2.03 R26.1
N$10
  Bottom 0.406: R13.1 38.84,19.05 37.29,19.05 36.95,18.71 U4.2
N$11
  Bottom 0.254: U4.3 36.58,16.46
  Bottom 0.406: R8.1 38.25,16.87 37.36,16.87 37.01,16.52 U4.3
N$13
  Bottom 0.254: Q4.1 8.21,8.95 10.31,11.05 10.31,12.19 11.21,13.09 R12.1
N$14
  Bottom 0.254: Q3.1 11.29,9.03 12.01,9.75 12.32,9.75 12.82,10.25 R11.1 12.83,11.4
N$16
  Bottom 0.406: R20.2 42.78,12.37 D2.A
N$17
  Bottom 0.61: R21.2 D4.A
N$18
  Bottom 0.61: D5.A 40.99,21.26 R22.2
N$19  (via drill 0.3)
  Top 0.254: OLED1.2 15.57,5.08 13.77,3.28 8.64,3.28 v7.9,2.54
  Bottom 0.254: C26.1 7.95,2.59 v7.9,2.54
N$21  (via drill 0.3)
  Top 0.254: OLED1.4 16.97,4.14 v16.79,3.96
  Bottom 0.254: C27.1 12.27,4.14 16.61,4.14 v16.79,3.96
N$22  (via drill 0.3)
  Top 0.254: OLED1.5 17.67,3.47 v17.5,3.3
  Bottom 0.254: v17.5,3.3 13.01,3.3 C27.2
N$23
  Bottom 0.61: U6.2 R27.1
N$25  (via drill 0.3)
  Top 0.254: USB-TTL.A5 4.57,22.68 v4.04,22.15
  Bottom 0.254: R31.2 v4.04,22.15
N$26  (via drill 0.3)
  Top 0.254: USB-TTL.B5 4.98,19.68 v4.04,20.62
  Bottom 0.254: R30.2 v4.04,20.62
N$27  (via drill 0.3)
  Top 0.254: v19.43,3.1 19.79,3.1 J3.3
  Bottom 0.254: v19.43,3.1 19.58,3.25 19.58,6.45 16.12,9.91 U4.11
N$28
  Bottom 0.254: J3.2 20.34,2.69 20.34,6.71 17.25,9.8 17.25,11.38 16.51,12.12 U4.12
N$29
  Bottom 0.406: U6.7 50.9,24.08 R28.2
N$30
  Bottom 0.406: U6.6 50.47,25.35 R29.2
N$31
  Bottom 0.406: R28.1 D8.C
N$32
  Bottom 0.406: R29.1 D9.C
N$33  (via drill 0.3)
  Top 0.254: USB-NATIVE.A5 5.3,11.36 v4.09,12.57
  Bottom 0.254: R46.2 3.73,12.93 v4.09,12.57
N$34  (via drill 0.3)
  Top 0.254: USB-NATIVE.B5 4.6,8.36 v4.09,7.85
  Bottom 0.254: R72.2 3.63,7.39 v4.09,7.85
N$35  (via drill 0.3)
  Top 0.254: U2.14 47.88,16.89 v48.06,16.71 | v43,16.71 14.99,16.71 v9.63,11.35
  Bottom 0.254: v48.06,16.71 v43,16.71 | v9.63,11.35 8.23,9.96 2.7,9.96 R65.2
N$36
  Bottom 0.406: U8.9 54.52,9.16 R80.2
N$37
  Bottom 0.406: U8.8 R79.2
N$76
  Bottom 0.61: U5.4 14.07,25 C30.1
RESET  (via drill 0.3)
  Top 0.254: v7.92,5.79 RST.2 | U2.3 61.85,23.47 61.11,22.73 56.52,22.73 v49.89,16.11 v49.89,16.1 | v44.6,15.42 15.7,15.42 | 15.7,15.42 15.67,15.42 | 15.7,15.42 9.04,8.76 v9.04,7.8
  Top 0.406: U2.3 61.85,26.72 | 61.85,26.72 61.85,27.35 C36.1 J1.3 | R63.1 61.83,26.7 61.85,26.72
  Bottom 0.254: v7.92,5.79 v7.92,5.8 Q4.3 v9.04,7.8 | v44.6,15.42 49.21,15.42 v49.89,16.1
RTS  (via drill 0.3)
  Top 0.254: v45.3,14.78 15.98,14.78 11.89,10.69 v11.89,10.44 | v48.9,14.78 v59,14.78
  Bottom 0.254: v45.3,14.78 v48.9,14.78 | Q4.2 9.99,9.41 10.97,10.39 11.02,10.44 | 11.02,10.44 11.27,10.68 | 11.27,10.68 11.3,10.72 11.3,11.4 R11.2 | 11.27,10.68 11.51,10.44 v11.89,10.44 11.02,10.44
  Bottom 0.406: U8.6 59,12.14 v59,14.78
RXD/IO44  (via drill 0.3)
  Top 0.254: U2.36 v59.31,5.46
  Bottom 0.254: R79.1 55.52,6.55 56.62,5.46 v59.31,5.46 60.89,3.88 J2.3
TXD/IO43  (via drill 0.3)
  Top 0.254: U2.37 60.58,5.31 60.02,4.75 v58.32,4.75
  Bottom 0.254: J2.4 58.35,4.72 v58.32,4.75 57.99,4.75 | 57.99,4.75 56.16,4.75 R80.1 | 57.99,4.75 58.34,4.39
USB_D+  (via drill 0.3)  (1 unrouted)
  Top 0.254: USB-NATIVE.B6 4.41,9.36 | 4.41,9.36 v3.99,8.94 | USB-NATIVE.A6 4.62,10.36 4.41,10.15 4.41,9.36 | 4.42,9.7 4.75,9.37
  Bottom 0.254: R65.1 v3.99,8.94
USB_D-  (via drill 0.3)
  Top 0.254: USB-NATIVE.A7 6.83,9.86 6.99,10.01 6.99,10.74 6.87,10.86 USB-NATIVE.B7 4.58,10.86 v4.01,11.43
  Bottom 0.254: R64.1 v4.01,11.43
VBAT  (via drill 0.3)  (1 unrouted)
  Top 0.254: v42.7,27.51 41.76,27.51 41.25,27 41.25,22.45 40.01,21.21 14.25,21.21 10.87,24.59 v10.87,28.83
  Bottom 0.254: 10.54,30.19 Q1.3 | C20.1 8.08,27.91 8.41,27.91 | 8.41,27.91 D11.+ | J6.1 8.26,28.06 8.41,27.91
  Bottom 0.406: U6.5 49.89,27.23 57.48,27.23 57.96,26.75 R19.2 | v42.7,27.51 48.28,27.51 | 48.59,27.51 57.4,27.51 C4.1 | 49.17,26.62 48.28,27.51 | 48.28,27.51 48.59,27.51 | 48.59,27.51 48.9,27.2 49.61,27.2 49.43,27.03 49.02,27.03
  pour Bottom: 7.47,27.25 9.91,27.25 11.07,28.42 11.07,30.84 7.52,30.84 7.47,30.84
VBUS  (via drill 0.3)  (3 unrouted)
  Top 0.305: USB-TTL.VBUS1 5.67,23.88 5.36,23.57 4.14,23.57 v4.04,23.67
  Top 0.61: USB-TTL.VBUS1 8.91,23.88 | 41.73,21.79 v43.1,21.79 42.19,22.71 42.06,22.71 | v8.71,21.89 8.71,23.68 8.91,23.88 | 8.91,23.88 10.46,23.88 | 10.46,23.88 13.79,20.55 40.49,20.55 41.73,21.79 | USB-TTL.VBUS2 8.67,18.98 v8.71,19.02 | v42.06,26.62 42.06,22.71 | 42.06,22.71 42.06,22.12 41.73,21.79 | v12.5,30.63 11.12,30.63 9.98,29.49 9.98,24.54 | 9.98,24.54 9.98,24.36 10.46,23.88 | 9.98,24.54 9.35,23.9 | 8.18,23.85 8.69,23.34 9.22,23.88
  Bottom 0.254: 8.69,19.53 8.71,19.51
  Bottom 0.305: C2.1 v4.04,23.67
  Bottom 0.61: v43.1,21.79 48.26,21.79 U6.8 51.21,22.81 C19.1 C44.2 R24.1 55.88,22.86 56.34,23.32 56.34,24.4 D8.A D9.A | Q1.1 12.51,30.64 v12.5,30.63 12.93,31.06 C18.1 | C1.1 3.91,19.1 4.65,19.84 7.14,19.84 | 7.14,19.84 7.16,19.84 | 7.39,19.84 8.43,19.84 D6.A | 7.16,19.84 7.82,19.18 7.82,18.72 9.6,18.72 9.6,19.38 9.32,19.1 8.13,19.1 7.39,19.84 | 7.39,19.84 7.16,19.84 | 7.14,19.84 7.82,20.52 7.85,20.52 | C41.2 C45.2 41.33,26.62 v42.06,26.62 U6.4
  Bottom 1.016: v8.71,21.89 D6.A D3.C
VDD  (via drill 0.3)
  Top 0.813: v9.96,22.91 13.37,19.5 v20.68,19.5 | v48.23,13.87 v60.5,13.87 | v20.68,13.87 v45,13.87
  Bottom 0.254: U5.1 10.19,22.7 D6.C 9.14,24.6 9.5,24.6 | 9.5,24.6 U5.3 11,24.67 C13.2 11,26.87 D11.- 12.05,28.92 Q1.2 | C7.1 9.32,24.77 9.5,24.6
  Bottom 0.813: v45,13.87 v48.23,13.87 | J2.1 60.5,7.47 v60.5,13.87 | v20.68,19.5 v20.68,13.87
  pour Bottom: 11.63,22.3 10.06,22.3 9.25,23.11 9.07,23.29 7.54,23.29 7.54,25.04 8.61,25.04 8.94,25.37 8.94,26.62 10.03,26.62 11.63,28.22 11.63,29.69 12.9,29.69 12.9,27.94 11.51,26.54 11.51,24.38 10.16,24.38 9.86,24.08 9.86,23.27 10.16,22.96 10.21,22.91 11.61,22.91 11.63,22.91

### Text on the board
tPlace: - | + | 3V3 | GND
bPlace: - | + | IO35 | IO26 | IO25 | IO15 | IO14 | IO13 | IO12 | IO2 | GND | RST | GND | 3V3 | www.makerfabs.com | ESP32-S3 AT | UWB Pro with | Display v1.0 | IO39 | IO36 | IO22 | IO17 | IO16 | IO5 | IO4 | IO0 | TXD | RXD | GND | VDD | 3V3 | CLK | DIO | GND